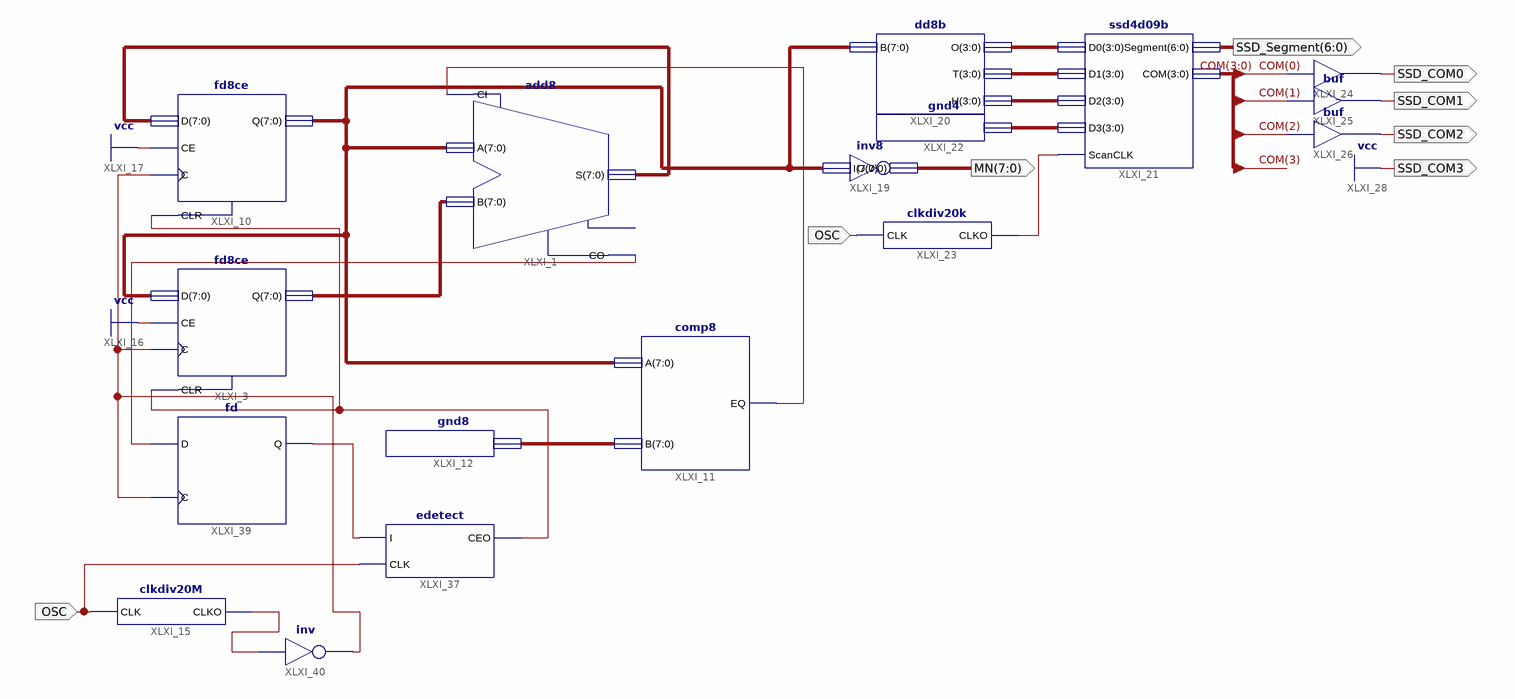
[diagram p0: schematic sheet 1]
// Xilinx ISE schematic main.sch (spartan6) as structural Verilog: 17 symbols, 7 ports
module main (
  input  OSC,
  output [6:0] SSD_Segment,
  output SSD_COM0,
  output SSD_COM1,
  output SSD_COM2,
  output SSD_COM3,
  output [7:0] MN
);

  wire XLXN_15, XLXN_21, XLXN_23, XLXN_27, XLXN_36, XLXN_66, XLXN_69;
  wire [3:0] COM, XLXN_32, XLXN_33, XLXN_34, XLXN_35;
  wire [7:0] XLXN_4, XLXN_11, XLXN_14, XLXN_16;

  add8 XLXI_1 (.A(XLXN_16), .B(XLXN_4), .CI(XLXN_15), .CO(XLXN_21), .S(XLXN_11));  // open: OFL
  fd8ce XLXI_3 (.C(XLXN_27), .CE(1'b1), .CLR(XLXN_23), .D(XLXN_16), .Q(XLXN_4));
  fd8ce XLXI_10 (.C(XLXN_27), .CE(1'b1), .CLR(XLXN_23), .D(XLXN_11), .Q(XLXN_16));
  comp8 XLXI_11 (.A(XLXN_16), .B(XLXN_14), .EQ(XLXN_15));
  gnd8 XLXI_12 (.GND(XLXN_14));
  clkdiv20M XLXI_15 (.CLK(OSC), .CLKO(XLXN_69));
  dd8b XLXI_20 (.B(XLXN_16), .H(XLXN_34), .O(XLXN_32), .T(XLXN_33));
  ssd4d09b XLXI_21 (
    .COM(COM), .D0(XLXN_32), .D1(XLXN_33), .D2(XLXN_34), .D3(XLXN_35), .ScanCLK(XLXN_36),
    .Segment(SSD_Segment));
  gnd4 XLXI_22 (.GND(XLXN_35));
  clkdiv20k XLXI_23 (.CLK(OSC), .CLKO(XLXN_36));
  buf XLXI_24 (SSD_COM0, COM[0]);
  buf XLXI_25 (SSD_COM1, COM[1]);
  buf XLXI_26 (SSD_COM2, COM[2]);
  edetect XLXI_37 (.CEO(XLXN_23), .CLK(OSC), .I(XLXN_66));
  inv8 XLXI_19 (.I(XLXN_16), .O(MN));
  fd XLXI_39 (.C(XLXN_27), .D(XLXN_21), .Q(XLXN_66));
  not XLXI_40 (XLXN_27, XLXN_69);

  assign SSD_COM3 = 1'b1;
endmodule
